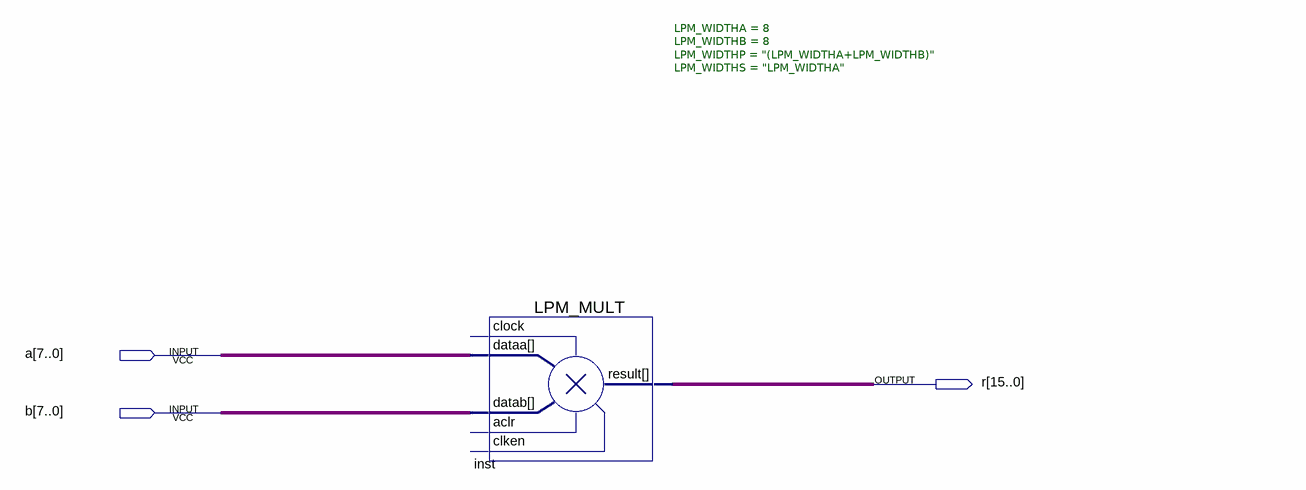
[diagram p0: schematic sheet]
// Quartus schematic lpm.bdf as structural Verilog: 1 symbols, 3 pins
module lpm (
  input  [7:0] a,
  input  [7:0] b,
  output [15:0] r
);

  LPM_MULT #(.LPM_WIDTHA(8), .LPM_WIDTHB(8), .LPM_WIDTHP("(LPM_WIDTHA+LPM_WIDTHB)"), .LPM_WIDTHS("LPM_WIDTHA")) inst (
    .dataa(a), .datab(b), .result(r));  // open: clock, aclr, clken
endmodule
